# EasyEDA schematic firestarter.json
TITLE: Key_matrix; REV: 1.0; Date: 2019-08-11; Sheet: 1/1; Drawn By: lcve; Company: Firestarter
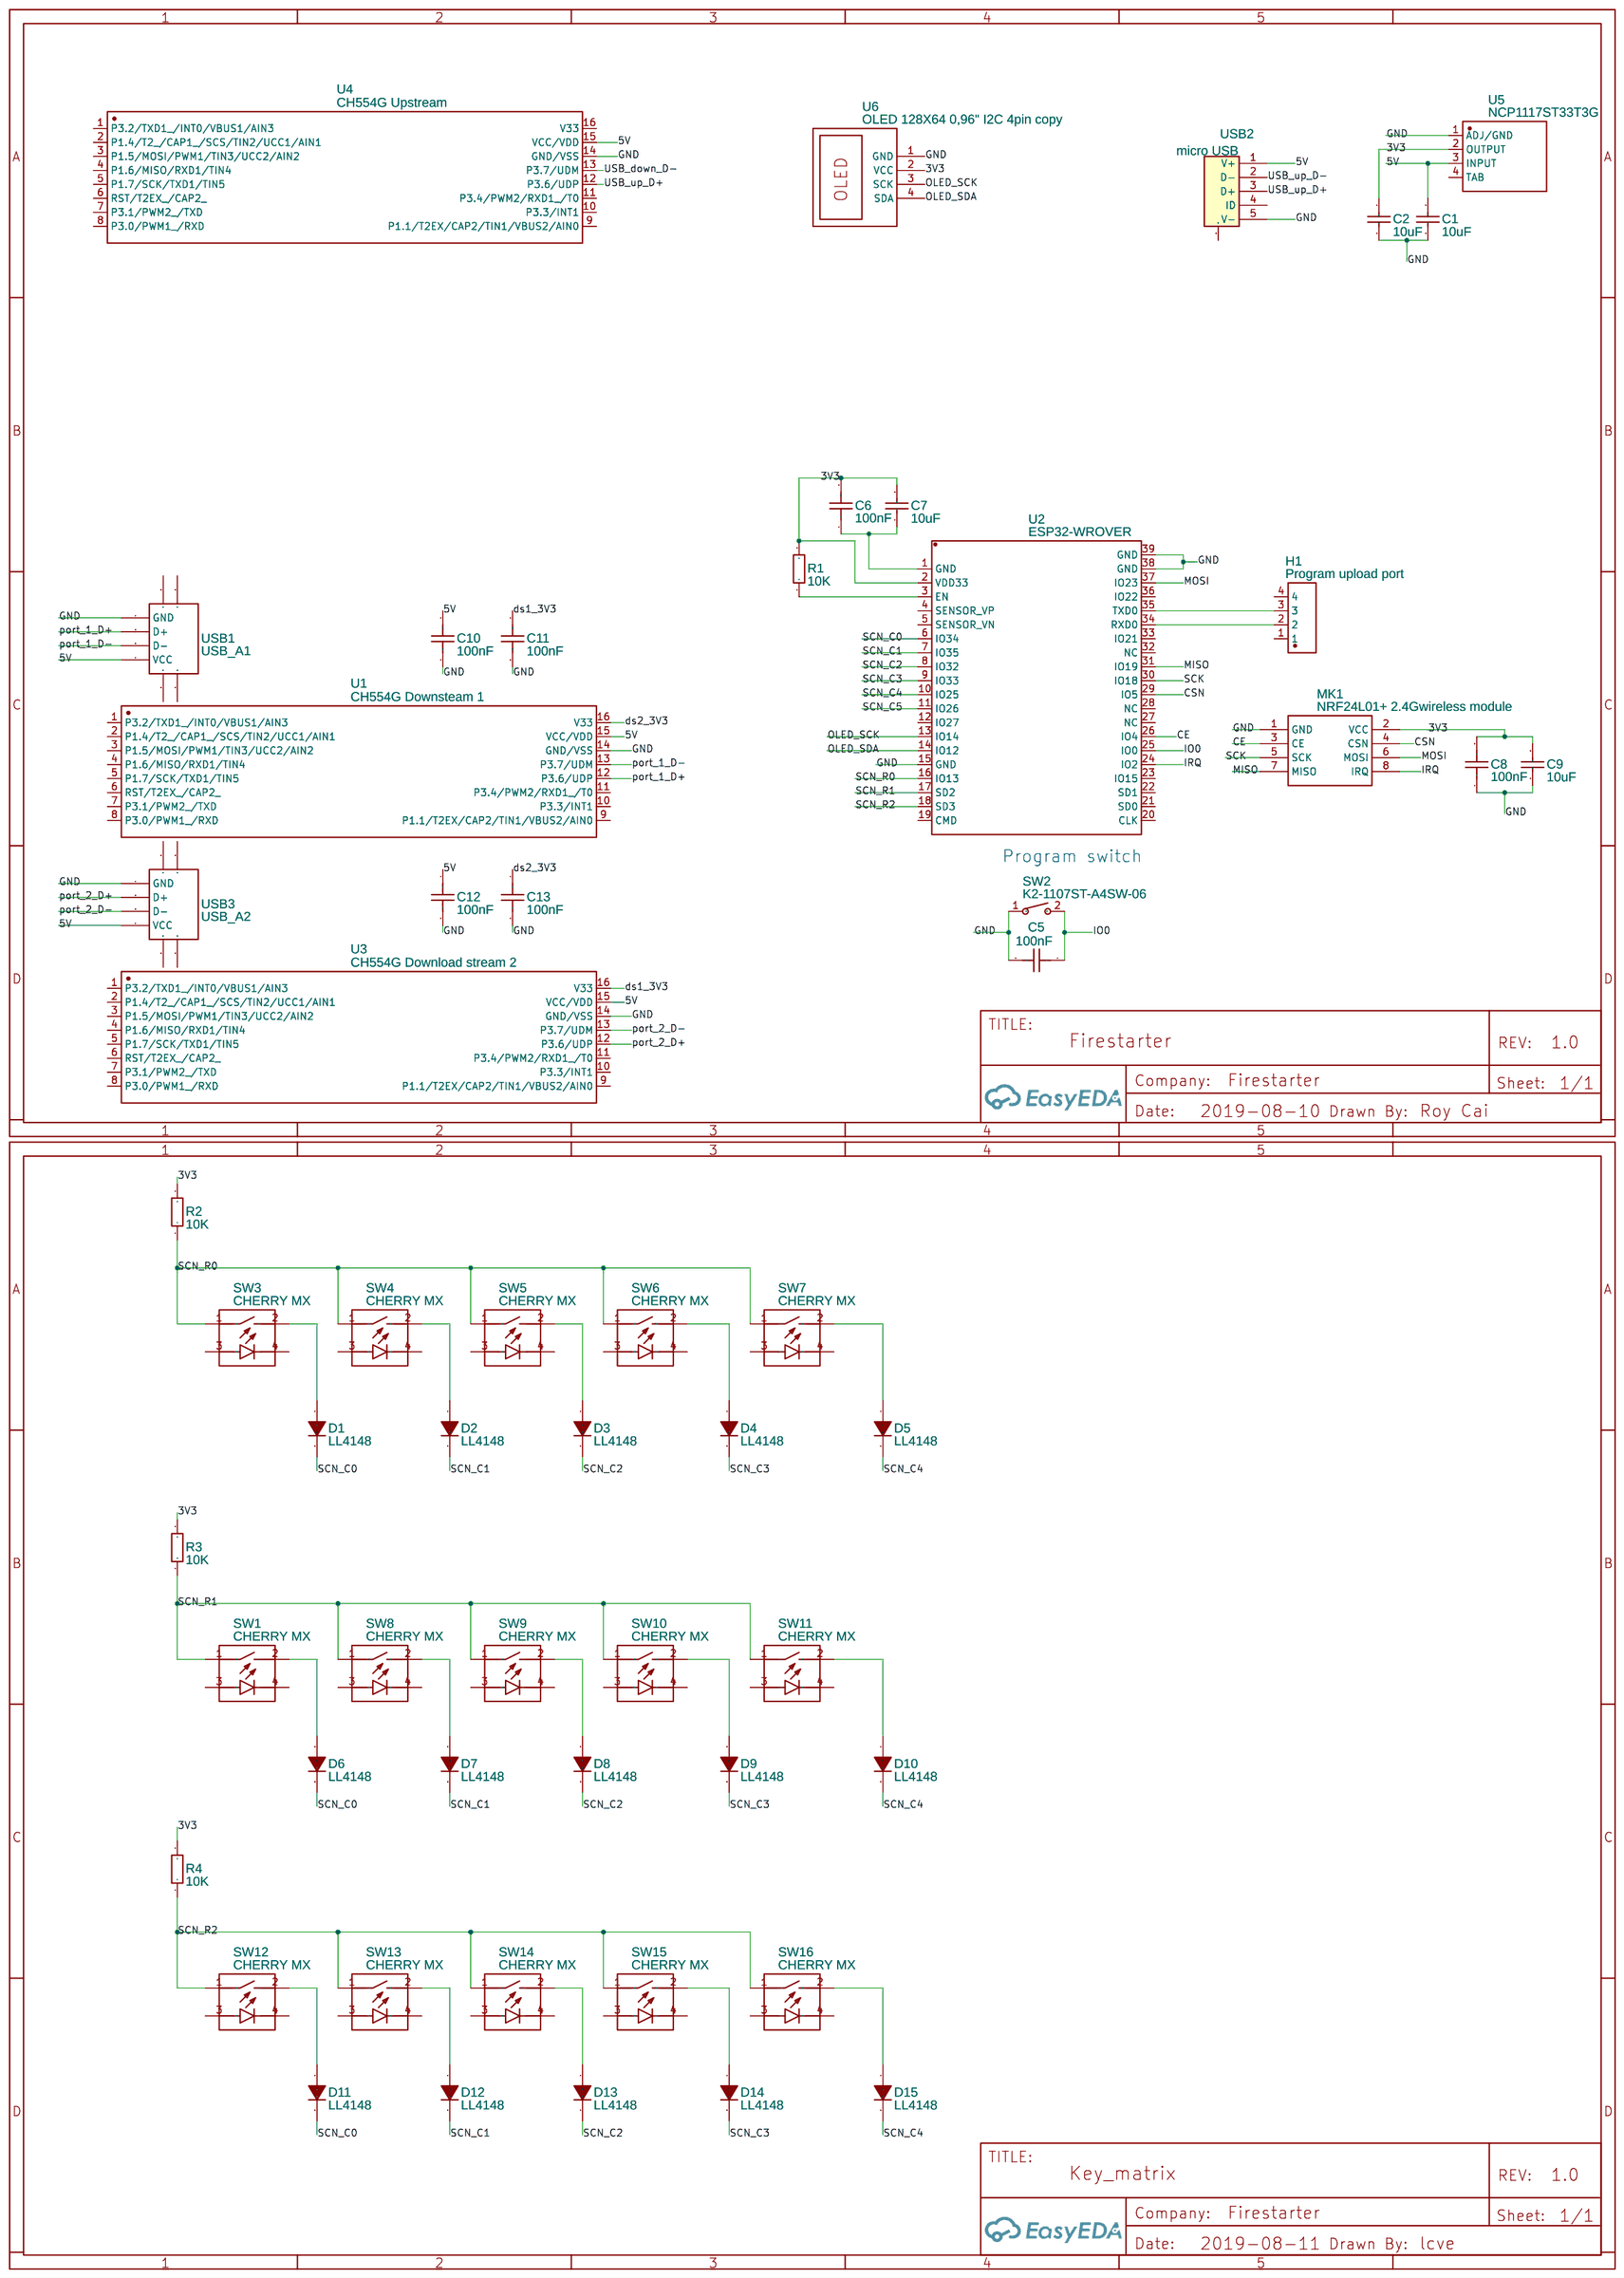
[diagram p0: schematic sheet]

## Parts
#1  -
C1  10uF  [1206]
C2  10uF  [1206]
C5  100nF  [1206]
C6  100nF  [1206]
C7  10uF  [1206]
C8  100nF  [1206]
C9  10uF  [1206]
C10  100nF  [1206]
C11  100nF  [1206]
C12  100nF  [1206]
C13  100nF  [1206]
D1  LL4148  [LL-34]
D2  LL4148  [LL-34]
D3  LL4148  [LL-34]
D4  LL4148  [LL-34]
D5  LL4148  [LL-34]
D6  LL4148  [LL-34]
D7  LL4148  [LL-34]
D8  LL4148  [LL-34]
D9  LL4148  [LL-34]
D10  LL4148  [LL-34]
D11  LL4148  [LL-34]
D12  LL4148  [LL-34]
D13  LL4148  [LL-34]
D14  LL4148  [LL-34]
D15  LL4148  [LL-34]
H1  Program upload port  [SIP-2.54MM-4P-CJT-H8.54]
MK1  NRF24L01+ 2.4Gwireless module  [NRF24L01]
R1  10K  [1206]
R2  10K  [1206]
R3  10K  [1206]
R4  10K  [1206]
SW1  CHERRY MX  [CHERRY MX 1U (CUSTOM) 1]
SW2  K2-1107ST-A4SW-06  [K2-1107ST-A4SW-06]
SW3  CHERRY MX  [CHERRY MX 1U (CUSTOM) 1]
SW4  CHERRY MX  [CHERRY MX 1U (CUSTOM) 1]
SW5  CHERRY MX  [CHERRY MX 1U (CUSTOM) 1]
SW6  CHERRY MX  [CHERRY MX 1U (CUSTOM) 1]
SW7  CHERRY MX  [CHERRY MX 1U (CUSTOM) 1]
SW8  CHERRY MX  [CHERRY MX 1U (CUSTOM) 1]
SW9  CHERRY MX  [CHERRY MX 1U (CUSTOM) 1]
SW10  CHERRY MX  [CHERRY MX 1U (CUSTOM) 1]
SW11  CHERRY MX  [CHERRY MX 1U (CUSTOM) 1]
SW12  CHERRY MX  [CHERRY MX 1U (CUSTOM) 1]
SW13  CHERRY MX  [CHERRY MX 1U (CUSTOM) 1]
SW14  CHERRY MX  [CHERRY MX 1U (CUSTOM) 1]
SW15  CHERRY MX  [CHERRY MX 1U (CUSTOM) 1]
SW16  CHERRY MX  [CHERRY MX 1U (CUSTOM) 1]
U1  CH554G Downsteam 1  [SOP-16_150MIL]
U2  ESP32-WROVER  [ESP32-WROVER]
U3  CH554G Download stream 2  [SOP-16_150MIL]
U4  CH554G Upstream  [SOP-16_150MIL]
U5  NCP1117ST33T3G  [SOT-223_4PIN_L6.30-W7.30-PITCH4.60-BL]
U6  OLED 128X64 0,96" I2C 4pin copy  [I2C - OLED 0.96" 128X64]
USB1  USB_A1  [USB-M-24]
USB2  micro USB  [MICRO-USB-1]
USB3  USB_A2  [USB-M-24]

## Library data of the parts
#1 = -: BOM_Manufacturer Part: ?
C1 C2 C7 C9 = CL31A106KOHNNNE: Supplier: LCSC; Manufacturer: SAMSUNG; Supplier Part: C1849
C5 C6 C8 C10-C13 = CC1206KRX7R9BB104: Supplier: LCSC; Manufacturer: YAGEO; Supplier Part: C82601
D1-D15 = -: Supplier: LCSC; Manufacturer: SEMTECH; LCSC Assembly: Yes; image: //image.lceda.cn/szlcsc/C9808.jpg; Supplier Part: C9808; SMT Type: Basic
H1 = -: Supplier: LCSC; Supplier Part: C225479; Manufacturer: Changjiang Connectors; Manufacturer Part: A2541WV-4P; Contributor: LCSC
MK1 = -: Supplier: LCSC; Manufacturer: Ai-Thinker; Manufacturer Part: NRF24L01+功率加强版绑定2.4Gwireless module; Supplier Part: C90751
R1-R4 = 1206W4F1002T5E: Supplier: LCSC; Manufacturer: UniOhm; LCSC Assembly: Yes; Supplier Part: C17902; SMT Type: Basic
SW1 SW3-SW16 = -: Manufacturer Part: MY CHERRY MX 2
SW2 = -: Supplier: LCSC; Supplier Part: C118141; Manufacturer: Rectangular Connectors - Contacts; Contributor: LCSC
U1 U3 U4 = -: Supplier: LCSC; Manufacturer: WCH; Manufacturer Part: CH554G; Contributor: LCSC; Supplier Part: C114295
U2 = -: Supplier: LCSC; Supplier Part: C129145; Manufacturer: Espressif Systems; Contributor: LCSC
U5 = -: Supplier: LCSC; Manufacturer: ON; image: //image.lceda.cn/szlcsc/C26537.jpg; Supplier Part: C26537; LCSC Assembly: Yes; SMT Type: Extend
U6 = -: Manufacturer Part: SSD1306 I2C OLED; Contributor: stozk
USB1 USB3 = -: Supplier: LCSC; Manufacturer: ValuePro; Manufacturer Part: A/F90degree Aparagraph 10Four feet without curling ironPBTWhite plastic6.8; image: //image.lceda.cn/szlcsc/C42580.jpg; Supplier Part: C42580
USB2 = -: Supplier: LCSC; Manufacturer: ValuePro; Manufacturer Part: micro USBFemale; image: //image.lceda.cn/szlcsc/C10418.jpg; Supplier Part: C10418

## Nets
3V3: C2.2 C6.2 C7.2 C8.2 C9.2 MK1.2(VCC) R1.2 R2.2 R3.2 R4.2 U2.2(VDD33) U5.2(OUTPUT) U6.2(VCC)
5V: C1.2 C10.1 C12.1 U1.15(VCC/VDD) U3.15(VCC/VDD) U4.15(VCC/VDD) U5.3(INPUT) USB1.1(VCC) USB2.1(V+) USB3.1(VCC)
GND: C1.1 C2.1 C5.2 C8.1 C9.1 C10.2 C11.2 C12.2 C13.2 MK1.1(GND) SW2.1 U1.14(GND/VSS) U2.15(GND) U2.38(GND) U2.39(GND) U3.14(GND/VSS) U4.14(GND/VSS) U5.1(ADJ/GND) U6.1(GND) USB1.4(GND) USB2.5(V-) USB3.4(GND)
CE: MK1.3(CE) U2.26(IO4)
CSN: MK1.4(CSN) U2.29(IO5)
ds1_3V3: C11.1 U3.16(V33)
ds2_3V3: C13.1 U1.16(V33)
IO0: C5.1 SW2.2 U2.25(IO0)
IRQ: MK1.8(IRQ) U2.24(IO2)
MISO: MK1.7(MISO) U2.31(IO19)
MOSI: MK1.6(MOSI) U2.37(IO23)
OLED_SCK: U2.13(IO14) U6.3(SCK)
OLED_SDA: U2.14(IO12) U6.4(SDA)
port_1_D+: U1.12(P3.6/UDP) USB1.3(D+)
port_1_D-: U1.13(P3.7/UDM) USB1.2(D-)
port_2_D+: U3.12(P3.6/UDP) USB3.3(D+)
port_2_D-: U3.13(P3.7/UDM) USB3.2(D-)
SCK: MK1.5(SCK) U2.30(IO18)
SCN_C0: D1.2(K) D6.2(K) D11.2(K) U2.6(IO34)
SCN_C1: D2.2(K) D7.2(K) D12.2(K) U2.7(IO35)
SCN_C2: D3.2(K) D8.2(K) D13.2(K) U2.8(IO32)
SCN_C3: D4.2(K) D9.2(K) D14.2(K) U2.9(IO33)
SCN_C4: D5.2(K) D10.2(K) D15.2(K) U2.10(IO25)
SCN_C5: U2.11(IO26)
SCN_R0: R2.1 SW3.1 SW4.1 SW5.1 SW6.1 SW7.1 U2.16(IO13)
SCN_R1: R3.1 SW1.1 SW8.1 SW9.1 SW10.1 SW11.1 U2.17(SD2)
SCN_R2: R4.1 SW12.1 SW13.1 SW14.1 SW15.1 SW16.1 U2.18(SD3)
USB_down_D-: U4.13(P3.7/UDM)
USB_up_D+: U4.12(P3.6/UDP) USB2.3(D+)
USB_up_D-: USB2.2(D-)
Net-(C6-1): C6.1 C7.1 U2.1(GND)
Net-(D1-1): D1.1(A) SW3.2
Net-(D2-1): D2.1(A) SW4.2
Net-(D3-1): D3.1(A) SW5.2
Net-(D4-1): D4.1(A) SW6.2
Net-(D5-1): D5.1(A) SW7.2
Net-(D6-1): D6.1(A) SW1.2
Net-(D7-1): D7.1(A) SW8.2
Net-(D8-1): D8.1(A) SW9.2
Net-(D9-1): D9.1(A) SW10.2
Net-(D10-1): D10.1(A) SW11.2
Net-(D11-1): D11.1(A) SW12.2
Net-(D12-1): D12.1(A) SW13.2
Net-(D13-1): D13.1(A) SW14.2
Net-(D14-1): D14.1(A) SW15.2
Net-(D15-1): D15.1(A) SW16.2
Net-(H1-2): H1.2 U2.34(RXD0)
Net-(H1-3): H1.3 U2.35(TXD0)
Net-(R1-1): R1.1 U2.3(EN)

Not connected (* = marked no-connect by the designer): H1 1 4; SW1 3 4; SW3 3 4; SW4 3 4; SW5 3 4; SW6 3 4; SW7 3 4; SW8 3 4; SW9 3 4; SW10 3 4; SW11 3 4; SW12 3 4; SW13 3 4; SW14 3 4; SW15 3 4; SW16 3 4; U1 1(P3.2/TXD1_/INT0/VBUS1/AIN3) 2(P1.4/T2_/CAP1_/SCS/TIN2/UCC1/AIN1) 3(P1.5/MOSI/PWM1/TIN3/UCC2/AIN2) 4(P1.6/MISO/RXD1/TIN4) 5(P1.7/SCK/TXD1/TIN5) 6(RST/T2EX_/CAP2_) 7(P3.1/PWM2_/TXD) 8(P3.0/PWM1_/RXD) 9(P1.1/T2EX/CAP2/TIN1/VBUS2/AIN0) 10(P3.3/INT1) 11(P3.4/PWM2/RXD1_/T0); U2 4(SENSOR_VP) 5(SENSOR_VN) 12(IO27) 19(CMD) 20(CLK) 21(SD0) 22(SD1) 23(IO15) 27(NC) 28(NC) 32(NC) 33(IO21) 36(IO22); U3 1(P3.2/TXD1_/INT0/VBUS1/AIN3) 2(P1.4/T2_/CAP1_/SCS/TIN2/UCC1/AIN1) 3(P1.5/MOSI/PWM1/TIN3/UCC2/AIN2) 4(P1.6/MISO/RXD1/TIN4) 5(P1.7/SCK/TXD1/TIN5) 6(RST/T2EX_/CAP2_) 7(P3.1/PWM2_/TXD) 8(P3.0/PWM1_/RXD) 9(P1.1/T2EX/CAP2/TIN1/VBUS2/AIN0) 10(P3.3/INT1) 11(P3.4/PWM2/RXD1_/T0); U4 1(P3.2/TXD1_/INT0/VBUS1/AIN3) 2(P1.4/T2_/CAP1_/SCS/TIN2/UCC1/AIN1) 3(P1.5/MOSI/PWM1/TIN3/UCC2/AIN2) 4(P1.6/MISO/RXD1/TIN4) 5(P1.7/SCK/TXD1/TIN5) 6(RST/T2EX_/CAP2_) 7(P3.1/PWM2_/TXD) 8(P3.0/PWM1_/RXD) 9(P1.1/T2EX/CAP2/TIN1/VBUS2/AIN0) 10(P3.3/INT1) 11(P3.4/PWM2/RXD1_/T0) 16(V33); U5 4(TAB); USB1 0; USB2 0(MTN) 4(ID); USB3 0

## Notes on the sheet
- Program switch
